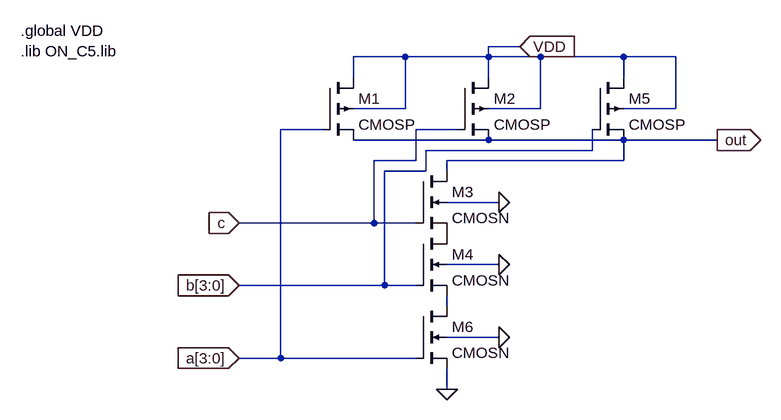
[diagram p0: schematic 3_input_nand.asc]
3_input_nand.asc, the LTspice schematic file:
Version 4
SHEET 1 900 680
WIRE 304 -80 256 -80
WIRE 128 -64 48 -64
WIRE 256 -64 256 -80
WIRE 256 -64 128 -64
WIRE 336 -64 256 -64
WIRE 464 -64 336 -64
WIRE 544 -64 464 -64
WIRE 48 -32 48 -64
WIRE 256 -32 256 -64
WIRE 464 -32 464 -64
WIRE 128 16 128 -64
WIRE 128 16 48 16
WIRE 336 16 336 -64
WIRE 336 16 256 16
WIRE 544 16 544 -64
WIRE 544 16 464 16
WIRE 0 48 -64 48
WIRE 208 48 144 48
WIRE 256 64 48 64
WIRE 464 64 256 64
WIRE 608 64 464 64
WIRE 416 80 416 48
WIRE 416 80 160 80
WIRE 144 96 144 48
WIRE 144 96 80 96
WIRE 464 96 464 64
WIRE 464 96 192 96
WIRE 160 112 160 80
WIRE 160 112 96 112
WIRE 192 112 192 96
WIRE 272 160 192 160
WIRE 80 192 80 96
WIRE 80 192 -128 192
WIRE 144 192 80 192
WIRE 272 256 192 256
WIRE 96 288 96 112
WIRE 96 288 -128 288
WIRE 144 288 96 288
WIRE 192 320 192 304
WIRE 272 368 192 368
WIRE -64 400 -64 48
WIRE -64 400 -128 400
WIRE 144 400 -64 400
WIRE 192 448 192 416
FLAG 272 160 0
FLAG -128 400 a[3:0]
IOPIN -128 400 In
FLAG -128 192 c
IOPIN -128 192 In
FLAG -128 288 b[3:0]
IOPIN -128 288 In
FLAG 608 64 out
IOPIN 608 64 Out
FLAG 192 448 0
FLAG 272 256 0
FLAG 272 368 0
FLAG 304 -80 VDD
IOPIN 304 -80 In
SYMBOL pmos4 0 -32 R0
SYMATTR InstName M1
SYMATTR Value CMOSP
SYMATTR Value2 l=0.6u w=1.8u
SYMBOL pmos4 208 -32 R0
SYMATTR InstName M2
SYMATTR Value CMOSP
SYMATTR Value2 l=0.6u w=1.8u
SYMBOL nmos4 144 112 R0
SYMATTR InstName M3
SYMATTR Value CMOSN
SYMATTR Value2 l=0.6u w=1.8u
SYMBOL nmos4 144 208 R0
SYMATTR InstName M4
SYMATTR Value CMOSN
SYMATTR Value2 l=0.6u w=1.8u
SYMBOL pmos4 416 -32 R0
SYMATTR InstName M5
SYMATTR Value CMOSP
SYMBOL nmos4 144 320 R0
SYMATTR InstName M6
SYMATTR Value CMOSN
TEXT -464 -104 Left 2 !.global VDD\n.lib ON_C5.lib

The netlist it stands for:
* 3_input_nand.asc
M1 VDD a[3:0] out VDD CMOSP l=0.6u w=1.8u
M2 VDD c out VDD CMOSP l=0.6u w=1.8u
M3 out c P001 0 CMOSN l=0.6u w=1.8u
M4 P001 b[3:0] N001 0 CMOSN l=0.6u w=1.8u
M5 VDD b[3:0] out VDD CMOSP
M6 N001 a[3:0] 0 0 CMOSN
.model NMOS NMOS
.model PMOS PMOS
.lib standard.mos
.global VDD
.lib ON_C5.lib
.backanno
.end